# Altium project EV306V1.1.PrjPCB
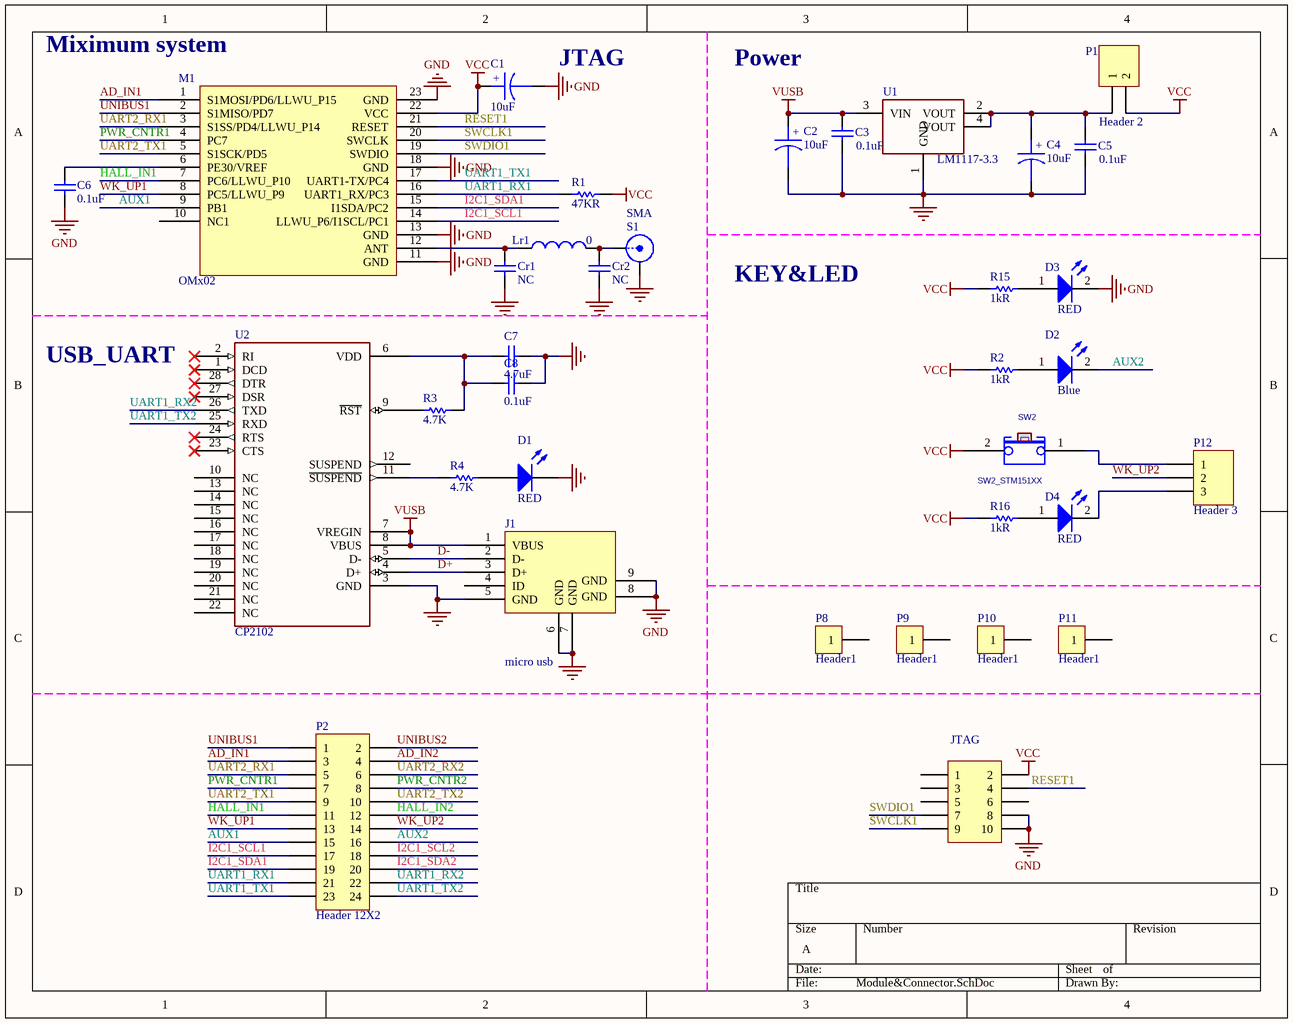
[diagram p0: Module&Connector.SchDoc]
2 sheets, 70 parts. Net scope: global (net labels, ports and power ports of the same name join across sheets).
Board files: EV306V1.1.PcbDoc, EV306V1.1-3x3.PcbDoc
Sheets:
  Module&Connector.SchDoc
  Sensor.SchDoc

## Sheet Module&Connector.SchDoc
size A

### Parts
C1  10uF  [0805]
C2  10uF  [0805]
C3  0.1uF  [0603RF]
C4  10uF  [0805]
C5  0.1uF  [0603RF]
C6  0.1uF  [0603RF]
C7  4.7uF  [0603RF]
C8  0.1uF  [0603RF]
Cr1  NC  [0603RF]
Cr2  NC  [0603RF]  (no BOM)
D1  RED  [LED0603]
D2  Blue  [LED0603]
D3  RED  [LED0603]
D4  RED  [LED0603]
J1  micro usb  [MICROUSB-D]
JTAG  IDC-10  [JTAG10-MINI]  (value not drawn)
Lr1  0  [0603RF]
M1  OMx02  [OMx02]
P1  Header 2  [HDR1X2]
P2  Header 12X2  [Header2X12]
P8  Header1  [Fix_Hole]
P9  Header1  [Fix_Hole]
P10  Header1  [Fix_Hole]
P11  Header1  [Fix_Hole]
P12  Header 3  [HDR1X3]
R1  47KR  [0603RF]
R2  1kR  [0603RF]
R3  4.7K  [0603RF]
R4  4.7K  [0603RF]
R15  1kR  [0603RF]
R16  1kR  [0603RF]
S1  SMA  [SMA]
SW2  SW2_STM151XX  [SW24*3]
U1  LM1117-3.3  [SOT-223]
U2  CP2102  [QFN28_CP2102]

### Nets
GND: C1.2 C2.2 C3.2 C4.2 C5.2 C6.1 C7.2 C8.2 Cr1.1 Cr2.1 D1.2(K) D3.2(K) J1.5(GND) J1.6(GND) J1.7(GND) J1.8(GND) J1.9(GND) JTAG.8 JTAG.10 M1.11(GND) M1.13(GND) M1.18(GND) M1.23(GND) S1.2(Y) U1.1(GND) U2.0(GND) U2.3(GND)
VCC: C1.1 JTAG.2 M1.22(VCC) P1.2 R1.2 R2.2 R15.2 R16.2 SW2.2(SW2)
VUSB: C2.1 C3.1 J1.1(VBUS) U1.3(VIN) U2.7(VREGIN) U2.8(VBUS)
AD_IN1: M1.1(S1MOSI/PD6/LLWU_P15) P2.3
AD_IN2: P2.4
AUX1: M1.9(PB1) P2.15
AUX2: D2.2(K) P2.16
D+: J1.3(D+) U2.4(D+)
D-: J1.2(D-) U2.5(D-)
HALL_IN1: M1.7(PC6/LLWU_P10) P2.11
HALL_IN2: P2.12
I2C1_SCL1: M1.14(LLWU_P6/I1SCL/PC1) P2.17
I2C1_SCL2: P2.18
I2C1_SDA1: M1.15(I1SDA/PC2) P2.19
I2C1_SDA2: P2.20
PWR_CNTR1: M1.4(PC7) P2.7
PWR_CNTR2: P2.8
RESET1: JTAG.4 M1.21(RESET)
SWCLK1: JTAG.9 M1.20(SWCLK)
SWDIO1: JTAG.7 M1.19(SWDIO)
UART1_RX1: M1.16(UART1_RX/PC3) P2.21 R1.1
UART1_RX2: P2.22 U2.26(TXD)
UART1_TX1: M1.17(UART1-TX/PC4) P2.23
UART1_TX2: P2.24 U2.25(RXD)
UART2_RX1: M1.3(S1SS/PD4/LLWU_P14) P2.5
UART2_RX2: P2.6
UART2_TX1: M1.5(S1SCK/PD5) P2.9
UART2_TX2: P2.10
UNIBUS1: M1.2(S1MISO/PD7) P2.1
UNIBUS2: P2.2
WK_UP1: M1.8(PC5/LLWU_P9) P2.13
WK_UP2: P2.14 P12.2
NetC4_1: C4.1 C5.1 P1.1 U1.2(VOUT) U1.4(VOUT)
NetC6_2: C6.2 M1.6(PE30/VREF)
NetC7_1: C7.1 C8.1 R3.2 U2.6(VDD)
NetCr1_2: Cr1.2 Lr1.1 M1.12(ANT)
NetCr2_2: Cr2.2 Lr1.2 S1.1(X)
NetD1_1: D1.1(A) R4.2
NetD2_1: D2.1(A) R2.1
NetD3_1: D3.1(A) R15.1
NetD4_1: D4.1(A) R16.1
NetD4_2: D4.2(K) P12.3
NetP12_1: P12.1 SW2.1(SW1)
NetR3_1: R3.1 U2.9(~{RST})
NetR4_1: R4.1 U2.11(~{SUSPEND})

Not connected (* = marked no-connect by the designer): J1 4(ID); JTAG 1 3 5 6; M1 10(NC1); P8 1; P9 1; P10 1; P11 1; U2 1(DCD)* 2(RI)* 10(NC) 12(SUSPEND) 13(NC) 14(NC) 15(NC) 16(NC) 17(NC) 18(NC) 19(NC) 20(NC) 21(NC) 22(NC) 23(CTS)* 24(RTS)* 27(DSR)* 28(DTR)*

### Notes on the sheet
- (near M1) Miximum system
- (near C1) JTAG
- Power
- KEY&LED
- USB_UART
- (in symbol CAPACITOR POL) +

### Library data of the parts
C1 C2 C4 = CAPACITOR POL: Capacitor
C3 C5 = Cap: Capacitor; Value: 10nF; Published: 8-Jun-2000; Revision: July-2002: Re-released for DXP Platform.; Publisher: Altium Limited
C6-C8 Cr1 Cr2 = Cap Semi: Capacitor (Semiconductor SIM Model); Published: 8-Jun-2000; LatestRevisionDate: 29-May-2009; LatestRevisionNote: IPC-7351 Footprint Added.; PackageReference: C1206; Publisher: Altium Limited; PackageDescription: Chip Capacitor
  C6 C8: Value: 0.1uF
  C7: Value: 4.7uF
  Cr1 Cr2: Value: NC
D1-D4 = LED2: Typical RED, GREEN, YELLOW, AMBER GaAs LED; Published: 8-Jun-2000; Publisher: Altium Limited
  D1: LatestRevisionDate: 17-Jul-2002; LatestRevisionNote: Re-released for DXP Platform.; PackageVersion: Feb-2002; PackageReference: 3.2X1.6X1.1; PackageDescription: SM LED; 2 Flat Leads
  D2-D4: Revision: July-2002: Re-released for DXP Platform.
J1 = micro usb: 同GDI401的USB接口一致
JTAG = Header 5X2: 双排插针2.54mm; LatestRevisionDate: 17-Jul-2002; LatestRevisionNote: Re-released for DXP Platform.; Publisher: Altium Limited
Lr1 = Inductor: Code_IEC: 1005; Published: 8-Jun-2000; LatestRevisionDate: 29-May-2009; LatestRevisionNote: IPC-7351 Footprint Added.; PackageReference: 0402-A; Publisher: Altium Limited; PackageDescription: Chip Inductor; Code_JEITA: 0402; Value: 0
P1 = Header 2: Header, 2-Pin; LatestRevisionDate: 17-Jul-2002; LatestRevisionNote: Re-released for DXP Platform.; Publisher: Altium Limited
P2 = Header 12X2: Header, 12-Pin, Dual row; LatestRevisionDate: 17-Jul-2002; LatestRevisionNote: Re-released for DXP Platform.; Publisher: Altium Limited
P12 = Header 3: Header, 3-Pin; LatestRevisionDate: 17-Jul-2002; LatestRevisionNote: Re-released for DXP Platform.; Publisher: Altium Limited
R1-R4 R15 R16 = Res Semi: Semiconductor Resistor; Published: 8-Jun-2000; LatestRevisionDate: 17-Jul-2002; LatestRevisionNote: Re-released for DXP Platform.; PackageReference: AXIAL-0.5; Publisher: Altium Limited; PackageDescription: Axial Device, Thru-Hole; 2 Leads; 0.5 in Pin Spacing
  R1: Value: 47KR
  R2 R15 R16: Value: 1kR
  R3 R4: Value: 4.7K
S1 = SMB: SMB Straight Connector; LatestRevisionDate: 17-Jul-2002; LatestRevisionNote: Re-released for DXP Platform.; Publisher: Altium Limited
SW2 = SW2_STM151XX: 轻触开关3x4x2,http://www.szlcsc.com/product/details_27383.html; CLASS: IC; AGILE_PN: 510-76958; MFG_NAME01: E SWITCH; MFG_PN01: TL1015BF160QG; CAD_APPROVED: Yes; ROHS: Yes; HEIGHT: 2MM
U1 = LM1117: LM1117 5V转3.3V电源芯片
U2 = CP2102: USB转UART芯片

## Sheet Sensor.SchDoc
size A
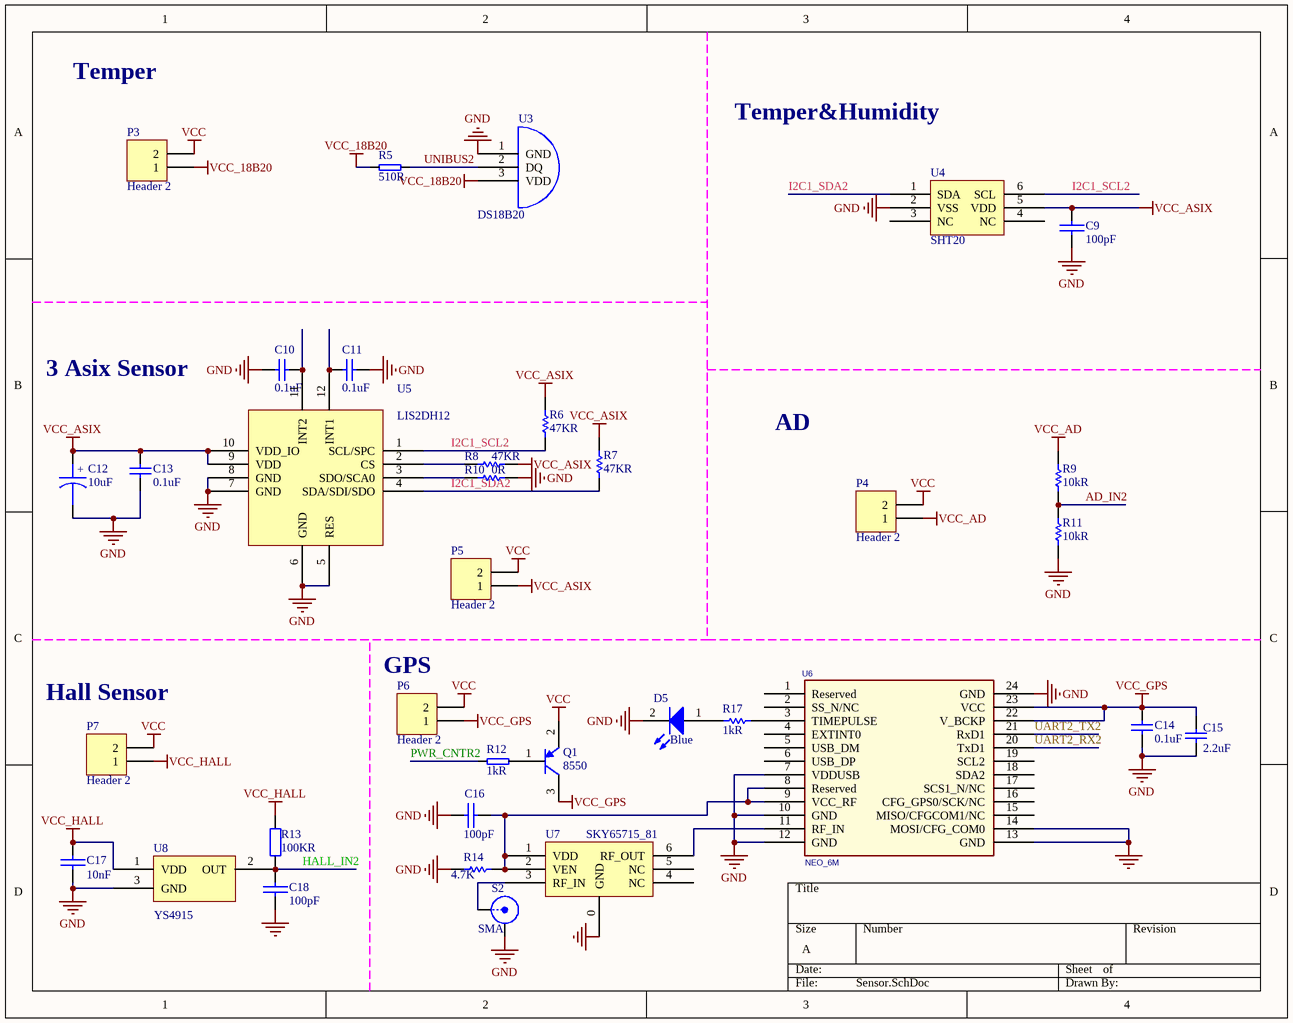
[diagram p1: Sensor.SchDoc]

### Parts
C9  100pF  [0603RF]
C10  0.1uF  [0603RF]
C11  0.1uF  [0603RF]
C12  10uF  [0805]
C13  0.1uF  [0603RF]
C14  0.1uF  [0603RF]
C15  2.2uF  [0603RF]
C16  100pF  [0603RF]
C17  10nF  [0603RF]
C18  100pF  [0603RF]
D5  Blue  [LED0603]
P3  Header 2  [HDR1X2]
P4  Header 2  [HDR1X2]
P5  Header 2  [HDR1X2]
P6  Header 2  [HDR1X2]
P7  Header 2  [HDR1X2]
Q1  8550  [SO-G3/Z3.3]
R5  510R  [0603RF]
R6  47KR  [0603RF]
R7  47KR  [0603RF]
R8  47KR  [0603RF]
R9  10kR  [0603RF]
R10  0R  [0603RF]
R11  10kR  [0603RF]
R12  1kR  [0603RF]
R13  100KR  [0603RF]
R14  4.7K  [0603RF]
R17  1kR  [0603RF]
S2  SMA  [SMA]
U3  DS18B20  [LC-TO-92(TO-92-3)]
U4  SHT20  [QFN6]
U5  LIS2DH12  [LIS2DH12]
U6  NEO_6M  [NEO-5]
U7  SKY65715_81  [SKY65715]
U8  YS4915  [SOT-23]

### Nets
GND: C9.1 C10.2 C11.1 C12.2 C13.1 C14.1 C15.2 C16.1 C17.1 C18.1 D5.2(K) R10.2 R11.2 R14.2 S2.2(Y) U3.1(GND) U4.2(VSS) U5.5(RES) U5.6(GND) U5.7(GND) U5.8(GND) U6.7(VDDUSB) U6.10(GND) U6.12(GND) U6.13(GND) U6.14(MOSI/CFG_COM0) U6.24(GND) U7.0(GND) U8.3(GND)
VCC: P3.2 P4.2 P5.2 P6.2 P7.2 Q1.2(E)
VCC_18B20: P3.1 R5.1 U3.3(VDD)
VCC_AD: P4.1 R9.1
VCC_ASIX: C9.2 C12.1 C13.2 P5.1 R6.2 R7.2 R8.2 U4.5(VDD) U5.9(VDD) U5.10(VDD_IO)
VCC_GPS: C14.2 C15.1 P6.1 Q1.3(C) U6.22(V_BCKP) U6.23(VCC)
VCC_HALL: C17.2 P7.1 R13.1 U8.1(VDD)
AD_IN2: R9.2 R11.1
HALL_IN2: C18.2 R13.2 U8.2(OUT)
I2C1_SCL2: R6.1 U4.6(SCL) U5.1(SCL/SPC)
I2C1_SDA2: R7.1 U4.1(SDA) U5.4(SDA/SDI/SDO)
PWR_CNTR2: R12.2
UART2_RX2: U6.20(TxD1)
UART2_TX2: U6.21(RxD1)
UNIBUS2: R5.2 U3.2(DQ)
NetC10_1: C10.1 U5.11(INT2)
NetC11_2: C11.2 U5.12(INT1)
NetC16_2: C16.2 R14.1 U6.8(Reserved) U6.9(VCC_RF) U7.1(VDD) U7.2(VEN)
NetD5_1: D5.1(A) R17.1
NetQ1_1: Q1.1(B) R12.1
NetR8_1: R8.1 U5.2(CS)
NetR10_1: R10.1 U5.3(SDO/SCA0)
NetR17_2: R17.2 U6.3(TIMEPULSE)
NetS2_1: S2.1(X) U7.3(RF_IN)
NetU6_11: U6.11(RF_IN) U7.6(RF_OUT)

Not connected (* = marked no-connect by the designer): U4 3(NC) 4(NC); U6 1(Reserved) 2(SS_N/NC) 4(EXTINT0) 5(USB_DM) 6(USB_DP) 15(MISO/CFGCOM1/NC) 16(CFG_GPS0/SCK/NC) 17(SCS1_N/NC) 18(SDA2) 19(SCL2); U7 4(NC) 5(NC)

### Notes on the sheet
- Temper
- Temper&Humidity
- 3 Asix Sensor
- AD
- (near P7) Hall Sensor
- (near P6) GPS
- (in symbol CAPACITOR POL) +

### Library data of the parts
C9 C17 C18 = CAP: Capacitor
C10 C11 C13-C15 = Cap Semi: Capacitor (Semiconductor SIM Model); Published: 8-Jun-2000; LatestRevisionDate: 29-May-2009; LatestRevisionNote: IPC-7351 Footprint Added.; PackageReference: C1206; Publisher: Altium Limited; PackageDescription: Chip Capacitor
  C10 C11 C13 C14: Value: 0.1uF
  C15: Value: 2.2uF
C12 = CAPACITOR POL: Capacitor
C16 = 100pF/50V,10%,C0603: Capacitor,100pF/50V,10%,C0603
D5 = LED2: as D1 on sheet Module&Connector; Published: 8-Jun-2000; Revision: July-2002: Re-released for DXP Platform.; Publisher: Altium Limited
P3-P7 = Header 2: Header, 2-Pin; LatestRevisionDate: 17-Jul-2002; LatestRevisionNote: Re-released for DXP Platform.; Publisher: Altium Limited
Q1 = 8550: PNP三极管
R5 R12 = R
R6-R11 R17 = Res Semi: Semiconductor Resistor; Published: 8-Jun-2000; LatestRevisionDate: 17-Jul-2002; LatestRevisionNote: Re-released for DXP Platform.; PackageReference: AXIAL-0.5; Publisher: Altium Limited; PackageDescription: Axial Device, Thru-Hole; 2 Leads; 0.5 in Pin Spacing
  R6-R8: Value: 47KR
  R9 R11: Value: 10kR
  R10: Value: 0R
  R17: Value: 1kR
R13 = Res2: Resistor; Published: 8-Jun-2000; LatestRevisionDate: 17-Jul-2002; LatestRevisionNote: Re-released for DXP Platform.; PackageReference: AXIAL-0.4; Publisher: Altium Limited; PackageDescription: Axial Device, Thru-Hole; 2 Leads; 0.4 in Pin Spacing; Value: 100KR
R14 = 0R,5%,R1206
S2 = SMB: SMB Straight Connector; LatestRevisionDate: 17-Jul-2002; LatestRevisionNote: Re-released for DXP Platform.; Publisher: Altium Limited
U6 = NEO_0: GPS模块
U7 = SKY65715
U8 = ES248L

## Nets that join several sheets
GND: Module&Connector (27 pins), Sensor (29 pins)
VCC: Module&Connector (9 pins), Sensor (6 pins)
AD_IN2: Module&Connector (P2.4), Sensor (R9.2 R11.1)
HALL_IN2: Module&Connector (P2.12), Sensor (C18.2 R13.2 U8.2)
I2C1_SCL2: Module&Connector (P2.18), Sensor (R6.1 U4.6 U5.1)
I2C1_SDA2: Module&Connector (P2.20), Sensor (R7.1 U4.1 U5.4)
PWR_CNTR2: Module&Connector (P2.8), Sensor (R12.2)
UART2_RX2: Module&Connector (P2.6), Sensor (U6.20)
UART2_TX2: Module&Connector (P2.10), Sensor (U6.21)
UNIBUS2: Module&Connector (P2.2), Sensor (R5.2 U3.2)